# EAGLE design Wiegand (EAGLE 6.5.0)
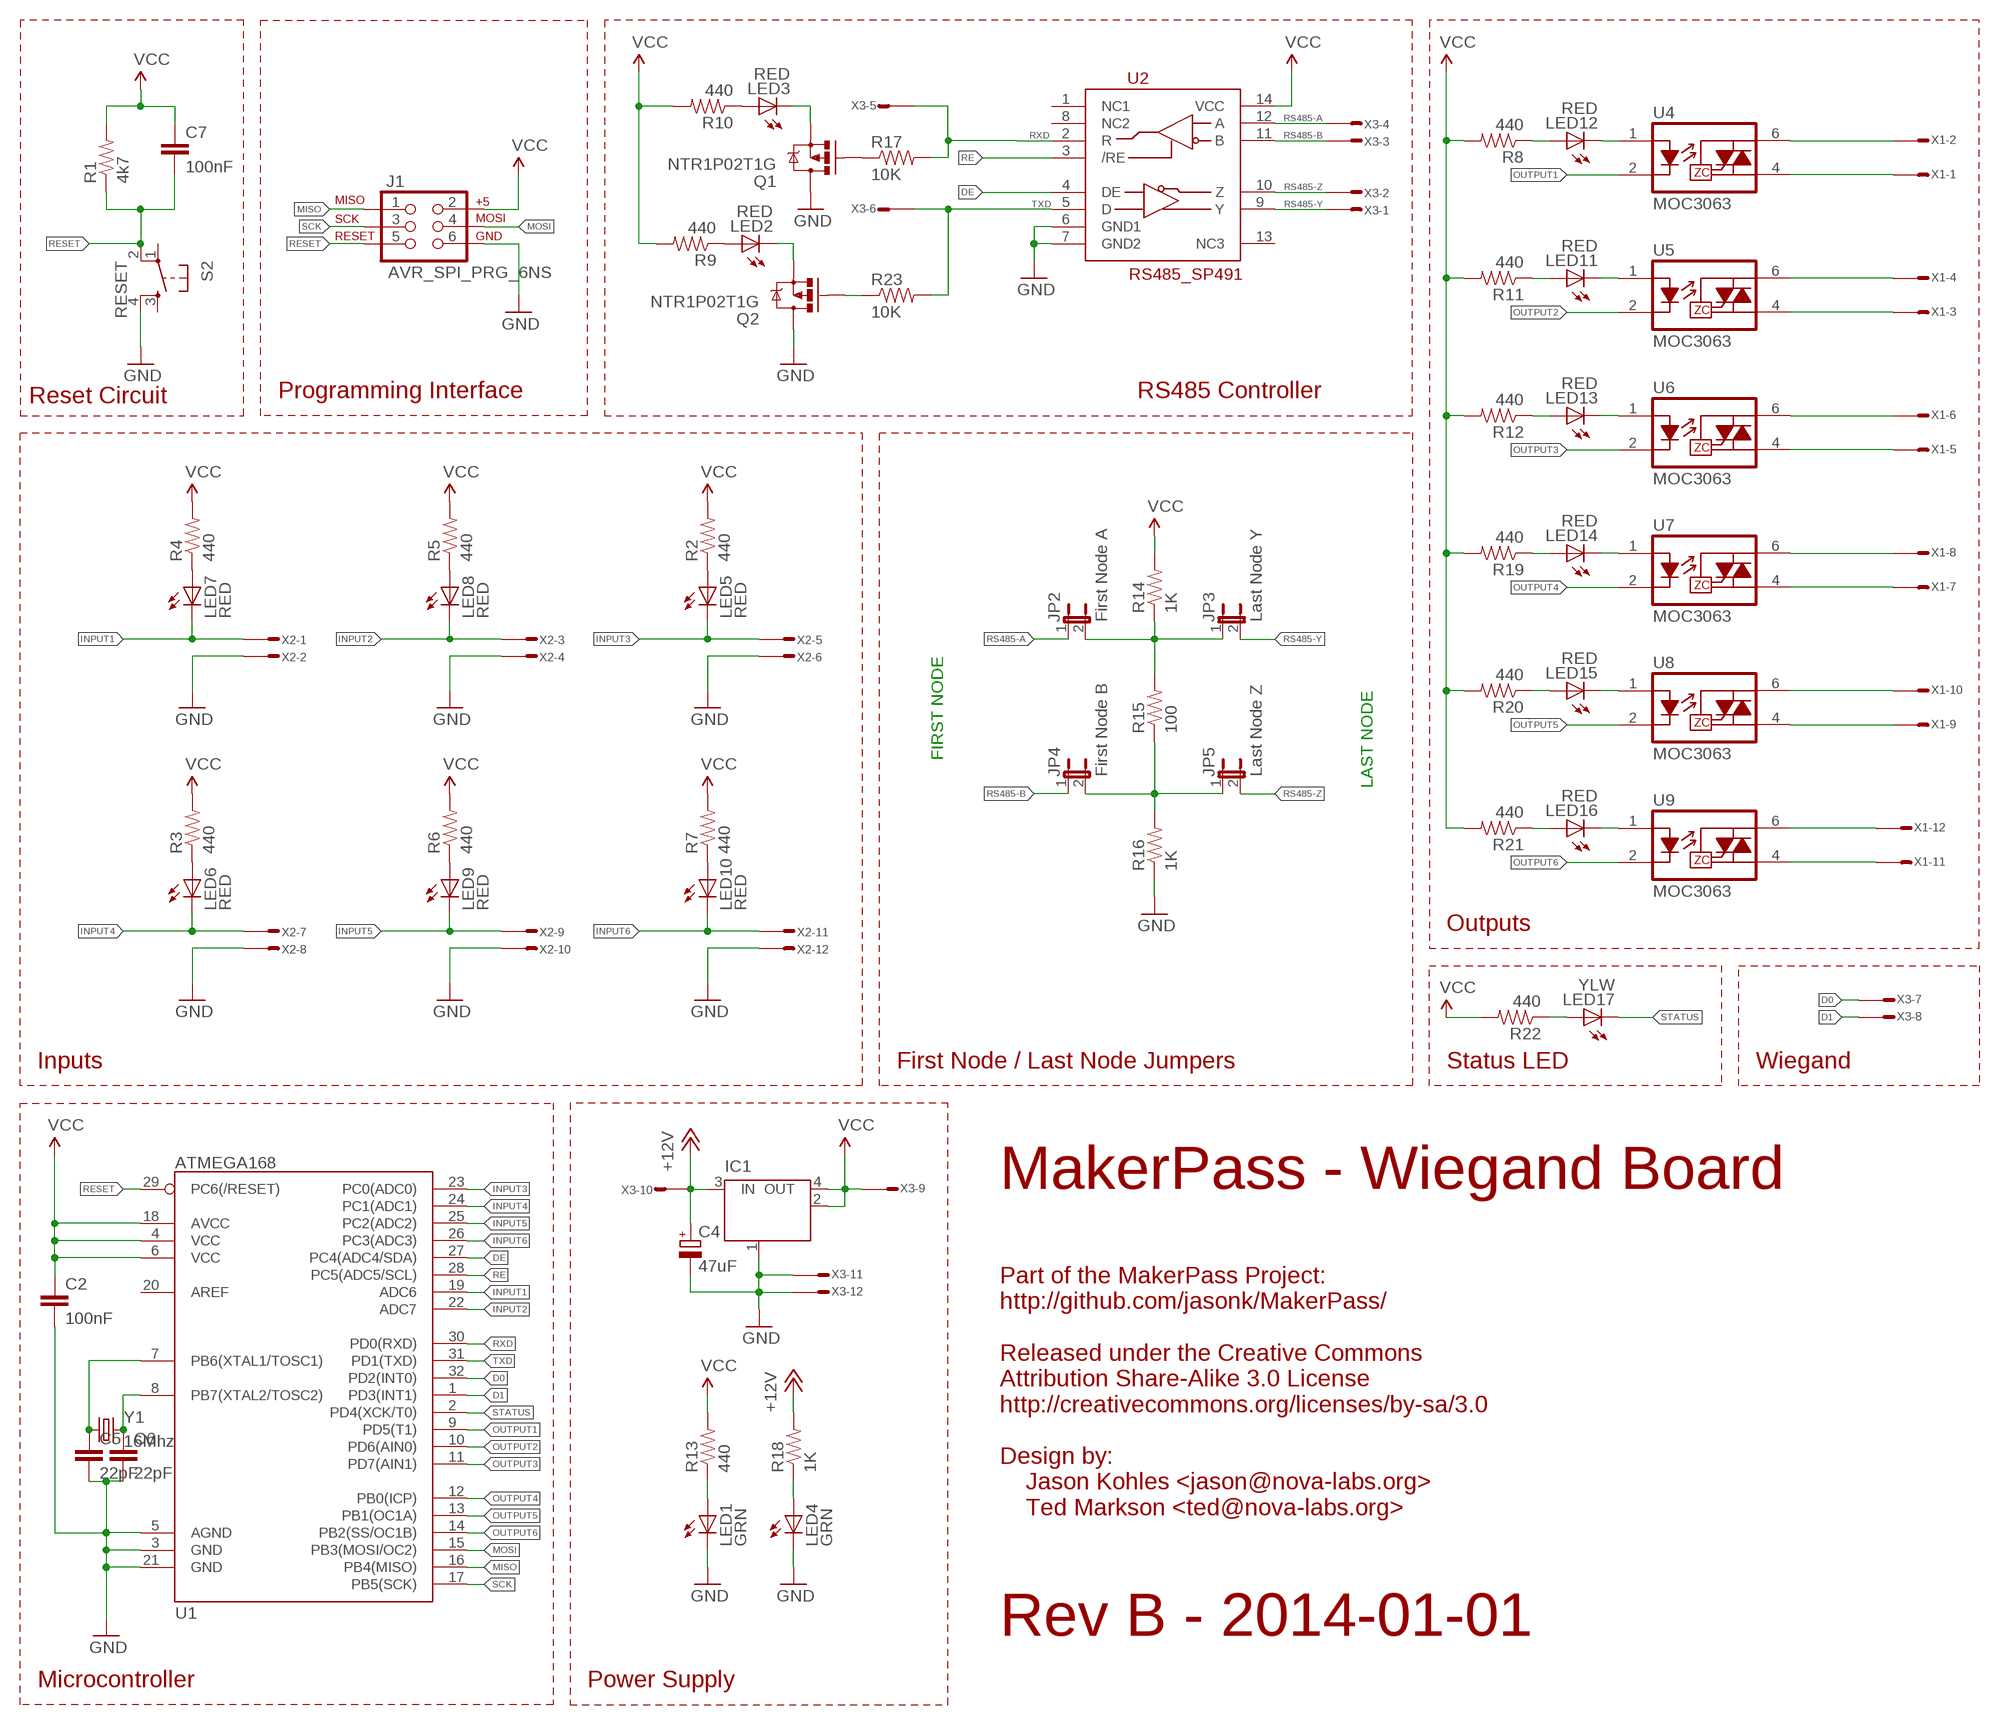
[diagram p0: schematic, sheet 1]

## Parts
C2  100nF  CAP0603-CAP  [0603-CAP]
C4  47uF  CPOL-EUD  [PANASONIC_D]
C5  22pF  CAP0603-CAP  [0603-CAP]
C6  22pF  CAP0603-CAP  [0603-CAP]
C7  100nF  CAP0603-CAP  [0603-CAP]
IC1  MC33269ST-3.3T3  [SOT223]
J1  AVR_SPI_PRG_6NS  [2X3-NS]
JP2  First Node A  JUMPER-2PTH  [1X02]
JP3  Last Node Y  JUMPER-2PTH  [1X02]
JP4  First Node B  JUMPER-2PTH  [1X02]
JP5  Last Node Z  JUMPER-2PTH  [1X02]
LED1  GRN  LED-0805  [LED-805]
LED2  RED  LED-0805  [LED-805]
LED3  RED  LED-0805  [LED-805]
LED4  GRN  LED-0805  [LED-805]
LED5  RED  LED-0805  [LED-805]
LED6  RED  LED-0805  [LED-805]
LED7  RED  LED-0805  [LED-805]
LED8  RED  LED-0805  [LED-805]
LED9  RED  LED-0805  [LED-805]
LED10  RED  LED-0805  [LED-805]
LED11  RED  LED-0805  [LED-805]
LED12  RED  LED-0805  [LED-805]
LED13  RED  LED-0805  [LED-805]
LED14  RED  LED-0805  [LED-805]
LED15  RED  LED-0805  [LED-805]
LED16  RED  LED-0805  [LED-805]
LED17  YLW  LED-0805  [LED-805]
Q1  NTR1P02T1G  MOSFET-PCHANNELSMD  [SOT23-3]
Q2  NTR1P02T1G  MOSFET-PCHANNELSMD  [SOT23-3]
R1  4k7  RESISTOR0603-RES  [0603-RES]
R2  440  RESISTOR0603-RES  [0603-RES]
R3  440  RESISTOR0603-RES  [0603-RES]
R4  440  RESISTOR0603-RES  [0603-RES]
R5  440  RESISTOR0603-RES  [0603-RES]
R6  440  RESISTOR0603-RES  [0603-RES]
R7  440  RESISTOR0603-RES  [0603-RES]
R8  440  RESISTOR0603-RES  [0603-RES]
R9  440  RESISTOR0603-RES  [0603-RES]
R10  440  RESISTOR0603-RES  [0603-RES]
R11  440  RESISTOR0603-RES  [0603-RES]
R12  440  RESISTOR0603-RES  [0603-RES]
R13  440  RESISTOR0603-RES  [0603-RES]
R14  1K  RESISTOR0603-RES  [0603-RES]
R15  100  RESISTOR0603-RES  [0603-RES]
R16  1K  RESISTOR0603-RES  [0603-RES]
R17  10K  RESISTOR0603-RES  [0603-RES]
R18  1K  RESISTOR0603-RES  [0603-RES]
R19  440  RESISTOR0603-RES  [0603-RES]
R20  440  RESISTOR0603-RES  [0603-RES]
R21  440  RESISTOR0603-RES  [0603-RES]
R22  440  RESISTOR0603-RES  [0603-RES]
R23  10K  RESISTOR0603-RES  [0603-RES]
S2  RESET  TAC_SWITCHSMD  [TACTILE_SWITCH_SMD]
U1  ATMEGA168  [TQFP32-08]
U2  RS485_SP491  [SOIC-14]
U4  MOC3063  MOC3063S  [DIP8SMD]
U5  MOC3063  MOC3063S  [DIP8SMD]
U6  MOC3063  MOC3063S  [DIP8SMD]
U7  MOC3063  MOC3063S  [DIP8SMD]
U8  MOC3063  MOC3063S  [DIP8SMD]
U9  MOC3063  MOC3063S  [DIP8SMD]
X1  CON-1X12-TERMBLOCK-3.5MM  [CON-1X12-TERMBLOCK-3.5MM]
X2  CON-1X12-TERMBLOCK-3.5MM  [CON-1X12-TERMBLOCK-3.5MM]
X3  CON-1X12-TERMBLOCK-3.5MM  [CON-1X12-TERMBLOCK-3.5MM]
Y1  16Mhz  CRYSTALSMD  [HC49UP]

## Nets
+12V [power]: C4.+ IC1.3(IN) R18.2 X3.10
D0: U1.32(PD2(INT0)) X3.7
D1: U1.1(PD3(INT1)) X3.8
DE: U1.27(PC4(ADC4/SDA)) U2.4(DE)
GND: C2.2 C4.- C5.2 C6.2 IC1.1(GND/ADJ) J1.6 LED1.C LED4.C Q1.3(D) Q2.3(D) R16.1 S2.4 U1.3(GND) U1.5(AGND) U1.21(GND) U2.6(GND1) U2.7(GND2) X2.2 X2.4 X2.6 X2.8 X2.10 X2.12 X3.11 X3.12
INPUT1: LED7.C U1.19(ADC6) X2.1
INPUT2: LED8.C U1.22(ADC7) X2.3
INPUT3: LED5.C U1.23(PC0(ADC0)) X2.5
INPUT4: LED6.C U1.24(PC1(ADC1)) X2.7
INPUT5: LED9.C U1.25(PC2(ADC2)) X2.9
INPUT6: LED10.C U1.26(PC3(ADC3)) X2.11
MISO: J1.1 U1.16(PB4(MISO))
MOSI: J1.4 U1.15(PB3(MOSI/OC2))
N$1: LED1.A R13.1
N$3: U8.4(T2) X1.9
N$4: U8.6(T1) X1.10
N$5: LED5.A R2.1
N$6: JP4.2 JP5.1 R15.1 R16.2
N$7: JP2.2 JP3.1 R14.1 R15.2
N$8: LED4.A R18.1
N$9: LED3.C Q1.2(S)
N$10: LED6.A R3.1
N$11: LED7.A R4.1
N$12: LED8.A R5.1
N$13: LED9.A R6.1
N$14: LED10.A R7.1
N$15: LED12.C U4.1(A)
N$16: LED12.A R8.1
N$17: U4.4(T2) X1.1
N$18: U4.6(T1) X1.2
N$19: U5.4(T2) X1.3
N$20: U5.6(T1) X1.4
N$21: LED11.A R11.1
N$22: LED11.C U5.1(A)
N$23: U6.4(T2) X1.5
N$24: U6.6(T1) X1.6
N$25: LED13.A R12.1
N$26: LED2.A R9.1
N$27: LED3.A R10.1
N$28: LED13.C U6.1(A)
N$29: U7.4(T2) X1.7
N$30: U7.6(T1) X1.8
N$31: LED14.A R19.1
N$32: LED14.C U7.1(A)
N$33: LED2.C Q2.2(S)
N$34: Q1.1(G) R17.1
N$35: LED15.A R20.1
N$36: LED15.C U8.1(A)
N$37: U9.4(T2) X1.11
N$38: U9.6(T1) X1.12
N$39: LED16.A R21.1
N$40: LED16.C U9.1(A)
N$41: LED17.A R22.1
N$42: Q2.1(G) R23.1
N$100: C5.1 U1.7(PB6(XTAL1/TOSC1)) Y1.1
N$101: C6.1 U1.8(PB7(XTAL2/TOSC2)) Y1.2
OUTPUT1: U1.9(PD5(T1)) U4.2(K)
OUTPUT2: U1.10(PD6(AIN0)) U5.2(K)
OUTPUT3: U1.11(PD7(AIN1)) U6.2(K)
OUTPUT4: U1.12(PB0(ICP)) U7.2(K)
OUTPUT5: U1.13(PB1(OC1A)) U8.2(K)
OUTPUT6: U1.14(PB2(SS/OC1B)) U9.2(K)
RE: U1.28(PC5(ADC5/SCL)) U2.3(/RE)
RESET: C7.2 J1.5 R1.1 S2.2 U1.29(PC6(/RESET))
RS485-A: JP2.1 U2.12(A) X3.4
RS485-B: JP4.1 U2.11(B) X3.3
RS485-Y: JP3.2 U2.9(Y) X3.1
RS485-Z: JP5.2 U2.10(Z) X3.2
RXD: R17.2 U1.30(PD0(RXD)) U2.2(R) X3.5
SCK: J1.3 U1.17(PB5(SCK))
STATUS: LED17.C U1.2(PD4(XCK/T0))
TXD: R23.2 U1.31(PD1(TXD)) U2.5(D) X3.6
VCC: C2.1 C7.1 IC1.2(OUT) IC1.4(OUT) J1.2 R1.2 R2.2 R3.2 R4.2 R5.2 R6.2 R7.2 R8.2 R9.2 R10.2 R11.2 R12.2 R13.2 R14.2 R19.2 R20.2 R21.2 R22.2 U1.4(VCC) U1.6(VCC) U1.18(AVCC) U2.14(VCC) X3.9
Unconnected: S2.1 S2.3 U1.20(AREF) U2.1(NC1) U2.8(NC2) U2.13(NC3)

## Notes on the sheet
- Reset Circuit | Programming Interface | RS485 Controller
- FIRST NODE
- LAST NODE
- Outputs
- Inputs | First Node / Last Node Jumpers | Status LED | Wiegand
- MakerPass - Wiegand Board
- Part of the MakerPass Project:
  http://github.com/jasonk/MakerPass/
  
  Released under the Creative Commons
  Attribution Share-Alike 3.0 License
  http://creativecommons.org/licenses/by-sa/3.0
  
  Design by:
      Jason Kohles <jason@nova-labs.org>
      Ted Markson <ted@nova-labs.org>
- Rev B - 2014-01-01
- Microcontroller | Power Supply

## Library data of the parts
C2 C7 = SparkFun:CAP: Capacitor Standard 0603 ceramic capacitor, and 0.1" leaded capacitor.; MFG_PN: 0603YC104KAT2A
C4 = rcl:CPOL-EU: POLARIZED CAPACITOR, European symbol; MFG_PN: EMVA250ADA470MF55G
C5 C6 = SparkFun:CAP: Capacitor Standard 0603 ceramic capacitor, and 0.1" leaded capacitor.; MFG_PN: 06035A220JAT2A
IC1 = linear:MC33269ST*: Adjustable Output Low Dropout Voltage Regulator 800 mA Source: http://www.onsemi.com/pub/Collateral/MC33269-D.PDF; MFG_PN: NCP1117ST50T3G
J1 = SparkFun-Connectors:AVR_SPI_PRG_6: AVR ISP 6 Pin This is the reduced ISP connector for AVR programming. Common on Arduino. This footprint will take up less PCB space and can be used with a 10-pin to 6-pin adapter such as SKU: BOB-08508
JP2-JP5 = SparkFun:JUMPER-2: Jumper Basic 0.1" spaced jumper. Use with breakaway headers.; MFG_PN: 1x2 pin header
LED1 LED4 = dp_devices:LED: Light Emitting Diode; MFG_PN: LG R971-KN-1
LED2 LED3 LED5-LED17 = dp_devices:LED: Light Emitting Diode; MFG_PN: LY R976-PS-36
Q1 Q2 = SparkFun:MOSFET-PCHANNEL; MFG_PN: NTR1P02T1G
R1 = SparkFun:RESISTOR: Resistor Basic schematic elements and footprints for 0603, 1206, and PTH resistors.; MFG_PN: ERJ-3GEYJ472V
R2-R13 R17 R19-R23 = SparkFun:RESISTOR: Resistor Basic schematic elements and footprints for 0603, 1206, and PTH resistors.; MFG_PN: ERJ3EKF3300V
R14-R16 R18 = SparkFun:RESISTOR: Resistor Basic schematic elements and footprints for 0603, 1206, and PTH resistors.; MFG_PN: ERJ-3EKF1001V
S2 = SparkFun:TAC_SWITCH: Momentary Switch Button commonly used for reset or general input. Spark Fun Electronics SKU : COM-00097; MFG_PN: PTS525SM10SMTRLFS
U1 = SparkFun-DigitalIC:ATMEGA168: Atmel 32-pin 8-bit micro, 16k flash.; MFG_PN: ATMEGA168-20AU
U2 = SparkFun:RS485_SP491; MFG_PN: SP491EEN-L
U4-U9 = SparkFun-DiscreteSemi:MOC3063*: Optotriac in DIP and SMD LED: Vf: 1.2V If: 5 mA TRIAC Vdrm: 600V Itsm: 1A Viso: 5000V DV/dt: 1500V/us DIP: MOC3063 SMD: MOC3063S; MFG_PN: MOC3063M
X1-X3 = LumisenseV6:CON-1X12: CON-1X12; MFG_PN: OSTTE120104
Y1 = SparkFun:CRYSTAL: Crystals Various standard crystals. Proven footprints. Spark Fun Electronics SKU : COM-00534; MFG_PN: FOXSDLF/160-20

## Board
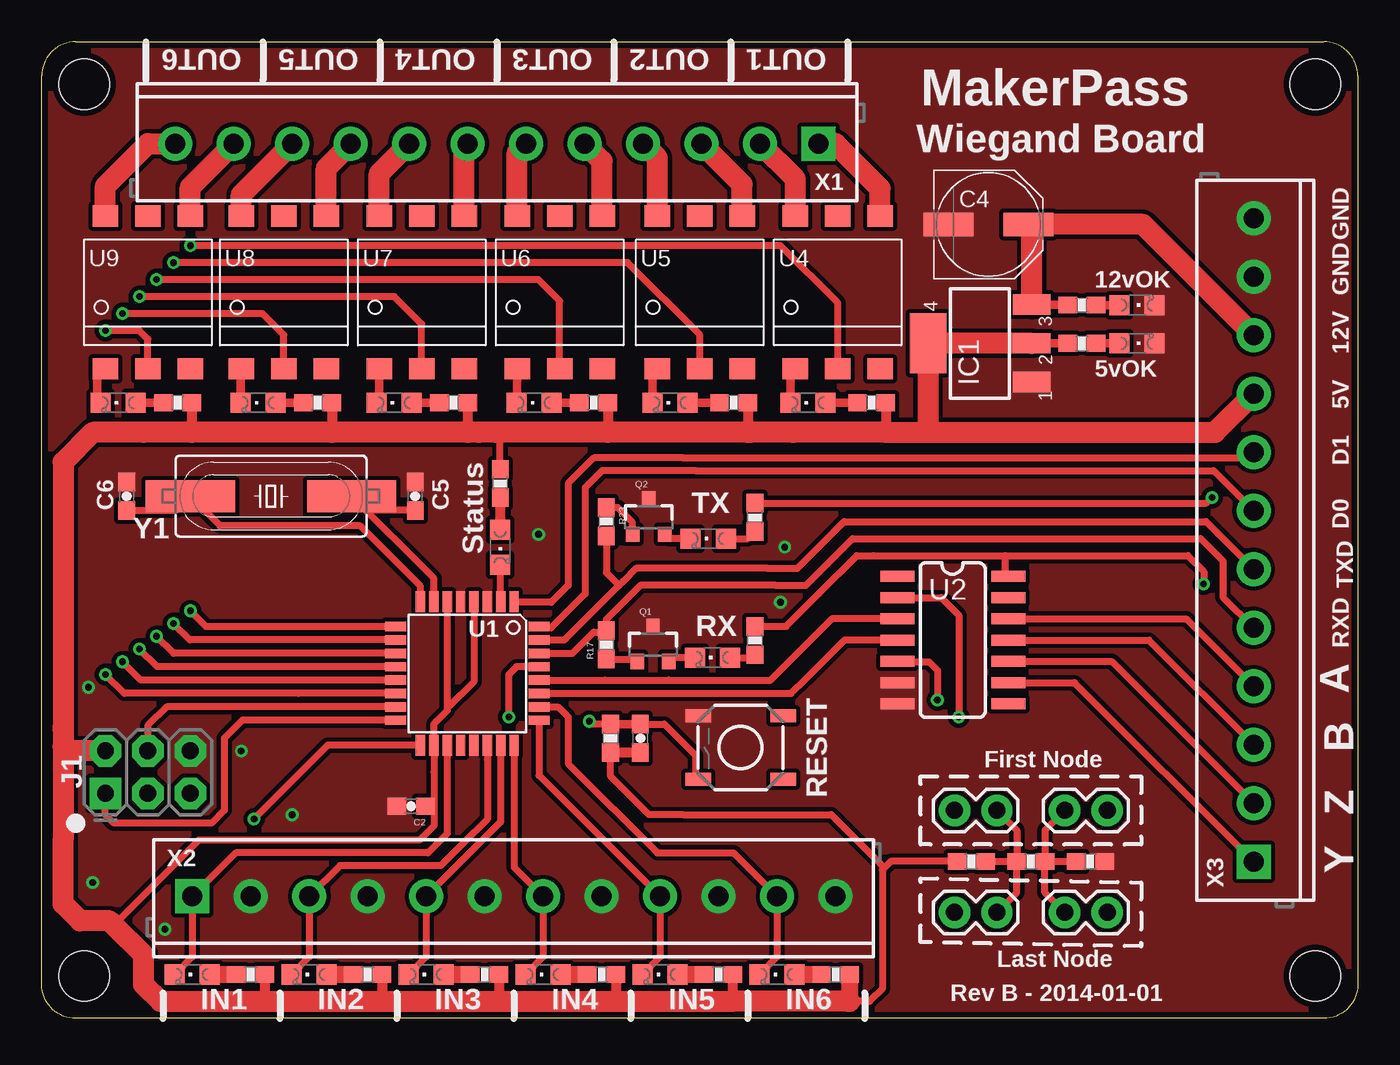
[diagram p1: board, top side]
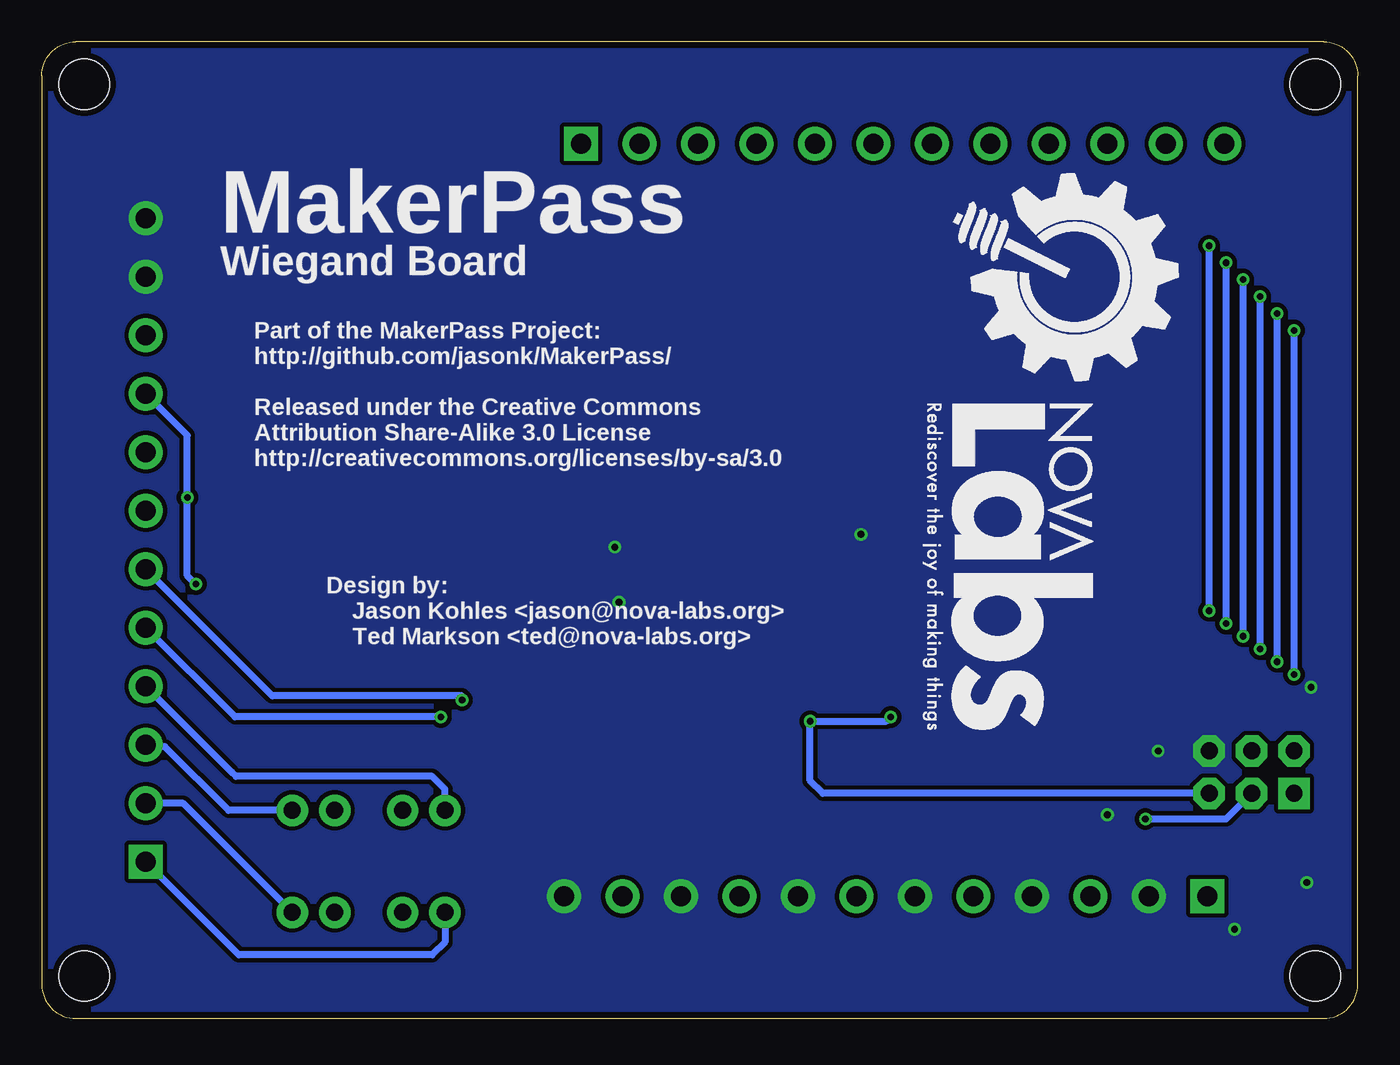
[diagram p2: board, bottom side, seen from below]

Size 78.74 x 58.42 mm. Coordinates in mm from the lower left corner, seen from the top.
Outline: 0,2.03 0,56.39 arc-90 2.03,58.42 76.71,58.42 arc-90 78.74,56.39 78.74,2.03 arc-90 76.71,0 2.03,0 arc-90 0,2.03
Copper layers (1*16): Top 0.0356mm / dielectric 1.5011mm / Bottom 0.0356mm
Design rules "OSHPark": minimum track width 6mil, minimum drill 13mil, track to track 6mil, track to pad 6mil, pad to pad 6mil, via to via 6mil, smd to smd 6mil, copper to edge 15mil, drill to drill 6mil, minimum pad ring 7mil, minimum via ring 7mil, stop-mask expansion 3mil, vias tented up to drill 0mil, thermal gap 10mil
Holes 3 mm at 2.54,2.54 76.2,2.54 2.54,55.88 76.2,55.88
tKeepout: area -0.5,-0.5 to 5.5,5.5; area 73.2,-0.5 to 79.2,5.5; area -0.5,52.9 to 5.5,58.9; area 73.2,52.9 to 79.2,58.9
bKeepout: area -0.5,-0.5 to 5.5,5.5; area 73.2,-0.5 to 79.2,5.5; area -0.5,52.9 to 5.5,58.9; area 73.2,52.9 to 79.2,58.9

### Footprints (pad centres in the part's own frame; a part is rotated, then mirrored left to right if it is on the bottom)
0603-CAP = smd 1.1 x 1: 1 -0.85,0; 2 0.85,0
PANASONIC_D = smd 3 x 1.4: + 2.4,0; - -2.4,0
SOT223 = smd 1.219 x 2.235: 1 -2.311,-3.099; 2 0,-3.099; 3 2.311,-3.099 | smd 3.6 x 2.2: 4 0,3.099
2X3-NS = drill 1.016 pad 1.88 square: 1 -2.54,-1.27 | drill 1.016 pad 1.88 octagon: 2 -2.54,1.27; 3 0,-1.27; 4 0,1.27; 5 2.54,-1.27; 6 2.54,1.27
1X02 = drill 1.016 pad 1.88: 1 0,0; 2 2.54,0
LED-805 = smd 1.2 x 1.2: A 0,-1.05; C 0,1.05
SOT23-3 = smd 0.8 x 0.9: 1 -0.95,-1; 2 0.95,-1; 3 0,1.1
0603-RES = smd 1.1 x 1: 1 -0.85,0; 2 0.85,0
TACTILE_SWITCH_SMD = smd 1.524 x 0.762: 1 -2.54,1.905; 2 2.54,1.905; 3 -2.54,-1.905; 4 2.54,-1.905
TQFP32-08 = smd 1.27 x 0.559: 1 -4.293,2.8; 2 -4.293,2; 3 -4.293,1.2; 4 -4.293,0.4; 5 -4.293,-0.4; 6 -4.293,-1.2; 7 -4.293,-2; 8 -4.293,-2.8; 17 4.293,-2.8; 18 4.293,-2; 19 4.293,-1.2; 20 4.293,-0.4; 21 4.293,0.4; 22 4.293,1.2; 23 4.293,2; 24 4.293,2.8 | smd 0.559 x 1.27: 9 -2.8,-4.293; 10 -2,-4.293; 11 -1.2,-4.293; 12 -0.4,-4.293; 13 0.4,-4.293; 14 1.2,-4.293; 15 2,-4.293; 16 2.8,-4.293; 25 2.8,4.293; 26 2,4.293; 27 1.2,4.293; 28 0.4,4.293; 29 -0.4,4.293; 30 -1.2,4.293; 31 -2,4.293; 32 -2.8,4.293
SOIC-14 = smd 0.66 x 2.032: 1 -4.445,-3.315; 2 -3.175,-3.315; 3 -1.905,-3.315; 4 -0.635,-3.315; 5 0.635,-3.315; 6 1.905,-3.315; 7 3.175,-3.315; 8 3.175,3.315; 9 1.905,3.315; 10 0.635,3.315; 11 -0.635,3.315; 12 -1.905,3.315; 13 -3.175,3.315; 14 -4.445,3.315
DIP8SMD = smd 1.524 x 1.27: 1 -2.54,-4.572; 2 0,-4.572; 3 2.54,-4.572; 4 2.54,4.572; 5 0,4.572; 6 -2.54,4.572
CON-1X12-TERMBLOCK-3.5MM = drill 1.2 pad 2.032 square: 1 0,0 | drill 1.2 pad 2.032: 2 3.5,0; 3 7,0; 4 10.5,0; 5 14,0; 6 17.5,0; 7 21,0; 8 24.5,0; 9 28,0; 10 31.5,0; 11 35,0; 12 38.5,0
HC49UP = smd 5.334 x 1.93: 1 -4.826,0; 2 4.826,0

### Placement (x,y rotation side)
C2  22.1,12.7 180 top
C4  56.64,47.5 0 top
C5  22.35,31.24 90 top
C6  5.08,31.24 90 top
C7  35.81,16.76 90 top
IC1  56.13,40.39 90 top
J1  6.35,14.73 0 top
JP2  54.61,12.45 0 top
JP3  57.15,6.35 180 top
JP4  63.75,12.45 180 top
JP5  61.21,6.35 0 top
LED1  65.53,40.39 270 top
LED2  39.88,28.7 90 top
LED3  40.13,21.59 90 top
LED4  65.53,42.67 270 top
LED5  23,2.63 90 top
LED6  30,2.63 90 top
LED7  9,2.63 90 top
LED8  16,2.63 90 top
LED9  37,2.63 90 top
LED10  44,2.63 90 top
LED11  37.59,36.83 90 top
LED12  45.85,36.83 90 top
LED13  29.46,36.83 90 top
LED14  21.08,36.83 90 top
LED15  12.95,36.83 90 top
LED16  4.57,36.83 90 top
LED17  27.43,28.19 180 top
Q1  36.58,22.35 0 top
Q2  36.32,29.97 0 top
R1  34.04,16.76 270 top
R2  26.5,2.63 0 top
R3  33.5,2.63 0 top
R4  12.5,2.63 0 top
R5  19.5,2.63 0 top
R6  40.5,2.63 0 top
R7  47.5,2.63 0 top
R8  49.66,36.83 0 top
R9  42.67,29.97 90 top
R10  42.67,22.61 90 top
R11  41.4,36.83 0 top
R12  33.02,36.83 0 top
R13  62.23,40.39 180 top
R14  55.63,9.4 180 top
R15  59.18,9.4 180 top
R16  62.74,9.4 180 top
R17  33.78,22.35 90 top
R18  62.23,42.67 180 top
R19  24.64,36.83 0 top
R20  16.51,36.83 0 top
R21  8.13,36.83 0 top
R22  27.43,32 90 top
R23  33.78,29.72 270 top
S2  41.82,16.21 180 top
U1  25.46,20.64 270 top
U2  54.51,22 270 top
U4  47.62,43.43 0 top
U5  39.37,43.43 0 top
U6  30.99,43.43 0 top
U7  22.73,43.43 0 top
U8  14.48,43.43 0 top
U9  6.35,43.43 0 top
U$4  [NOVALABS]  26.92,51.05 270 bottom
X1  46.48,52.32 180 top
X2  9,7.3 0 top
X3  72.51,9.37 90 top
Y1  13.72,31.24 180 top

### Tracks (layer width: path | path; a pad name or v marks a point on that pad's centre or on a via)
+12V
  Top 0.508: IC1.3 61.35,42.7 R18.2
  Top 1.27: C4.+ 59.23,47.5 | X3.10 65.89,47.5 C4.+ | IC1.3 59.23,47.31 C4.+
D0
  Top 0.406: 29.79,23.44 U1.32 29.83,23.37 30.48,23.37 32.51,25.4 32.51,31.75 33.53,32.77 39.12,32.77 70.12,32.77 X3.7
D1
  Top 0.406: X3.8 72.17,33.53 38.35,33.53 33.02,33.53 31.5,32 31.5,25.91 30.48,24.89 28.3,24.89 U1.1 28.49,24.93
DE
  Top 0.406: U1.27 35.19,19.44 36.71,19.44 44.84,19.44 45.72,20.32 48.03,22.64 U2.4
GND  (via drill 0.41)
  other vias: 2.79,19.81 7.37,5.33 44.45,28.19 44.2,24.89 3.05,8.13 11.94,16 14.99,12.19 29.72,28.96
  pour Top (isolate 0.254, rank 6, no thermals): 0,0 78.74,0 78.74,58.42 0,58.42
  pour Bottom (isolate 0.254, no thermals): 0,0 78.74,0 78.74,58.42 0,58.42
INPUT1
  Top 0.406: LED7.C 9,3.68 X2.1 11.6,9.91 23.11,9.91 24.26,11.05 U1.19
INPUT2
  Top 0.406: LED8.C 16,3.68 X2.3 17.84,9.14 23.88,9.14 25.15,10.41 26.66,11.93 26.66,15.49 U1.22
INPUT3
  Top 0.406: LED5.C 23,3.68 X2.5 27.46,11.76 U1.23
INPUT4
  Top 0.406: LED6.C 30,3.68 X2.7 28.26,9.04 U1.24
INPUT5
  Top 0.406: LED9.C 37,3.68 X2.9 29.75,14.55 U1.25
INPUT6
  Top 0.406: LED10.C 44,3.68 X2.11 41.4,9.91 36.83,9.91 31.5,15.24 31.5,18.03 30.89,18.64 U1.26
MISO
  Top 0.406: U1.16 12,17.84 10.92,16.76 10.92,12.45 10.16,11.68 4.32,11.68 3.81,12.19 J1.1
MOSI
  Top 0.406: U1.15 7.46,18.64 6.35,17.53 J1.4
N$1
  Top 0.508: LED1.A R13.1
N$3
  Top 1.27: U8.4 17.02,50.86 X1.9
N$4
  Top 1.27: U8.6 11.94,49.28 X1.10
N$5
  Top 1.016: R2.1 LED5.A
N$6
  Top 0.406: R15.1 R16.2 | JP4.2 60.03,11.26 R15.1 | JP5.1 60.03,7.53 R15.1
N$7
  Top 0.406: R14.1 R15.2 | JP2.2 58.33,11.26 R15.2 | JP3.1 58.33,7.53 R15.2
N$8
  Top 0.508: R18.1 LED4.A
N$9
  Top 0.406: LED3.C 37.76,21.59 Q1.2
N$10
  Top 1.016: R3.1 LED6.A
N$11
  Top 1.016: R4.1 LED7.A
N$12
  Top 1.016: R5.1 LED8.A
N$13
  Top 1.016: R6.1 LED9.A
N$14
  Top 1.016: R7.1 LED10.A
N$15
  Top 0.508: LED12.C 44.8,38.57 U4.1
N$16
  Top 0.508: LED12.A R8.1
N$17
  Top 1.27: U4.4 50.16,49.66 47.5,52.32 X1.1
N$18
  Top 1.27: U4.6 45.09,50.22 X1.2
N$19
  Top 1.27: U5.4 41.91,49.9 X1.3
N$20
  Top 1.27: U5.6 36.83,51.48 X1.4
N$21
  Top 0.508: LED11.A R11.1
N$22
  Top 0.508: LED11.C 36.54,38.57 U5.1
N$23
  Top 1.27: U6.4 33.53,51.28 X1.5
N$24
  Top 1.27: U6.6 28.45,51.79 X1.6
N$25
  Top 0.508: R12.1 LED13.A
N$26
  Top 0.406: LED2.A 42.25,28.7 R9.1
N$27
  Top 0.406: LED3.A 42.51,21.59 R10.1
N$28
  Top 0.508: U6.1 28.45,36.86 LED13.C
N$29
  Top 1.27: U7.4 25.27,52.12 X1.7
N$30
  Top 1.27: U7.6 20.19,50.53 X1.8
N$31
  Top 0.508: LED14.A R19.1
N$32
  Top 0.508: U7.1 20.19,36.99 LED14.C
N$33
  Top 0.406: LED2.C 37.54,28.7 Q2.2
N$34
  Top 0.406: R17.1 35.48,21.5 Q1.1
N$35
  Top 0.508: LED15.A R20.1
N$36
  Top 0.508: LED15.C 11.9,38.83 U8.1
N$37
  Top 1.27: U9.4 8.89,49.73 X1.11
N$38
  Top 1.27: U9.6 3.81,49.78 6.35,52.32 X1.12
N$39
  Top 0.508: LED16.A R21.1
N$40
  Top 0.508: U9.1 3.33,38.38 3.33,37.03 LED16.C
N$41
  Top 0.61: R22.1 LED17.A
N$42
  Top 0.406: R23.1 34.46,30.57 35.31,29.72 35.31,29.04 Q2.1
N$100
  Top 0.406: U1.7 23.46,26.32 Y1.1 19.39,30.39 C5.1
N$101
  Top 0.406: U1.8 22.66,25.85 19.05,29.46 10.67,29.46 Y1.2 8.04,30.39 C6.1
OUTPUT1  (via drill 0.41)
  Top 0.406: U4.2 47.62,42.8 44.2,46.23 v8.89,46.23 | U1.9 9.83,23.44 v8.89,24.38
  Bottom 0.406: v8.89,24.38 v8.89,46.23
OUTPUT2  (via drill 0.41)
  Top 0.406: U1.10 8.86,22.64 v7.87,23.62 | U5.2 39.37,40.89 35.05,45.21 v7.87,45.21
  Bottom 0.406: v7.87,23.62 v7.87,45.21
OUTPUT3  (via drill 0.41)
  Top 0.406: U1.11 7.88,21.84 v6.86,22.86 | U6.2 30.99,42.93 29.72,44.2 v6.86,44.2
  Bottom 0.406: v6.86,22.86 v6.86,44.2
OUTPUT4  (via drill 0.41)
  Top 0.406: U1.12 6.9,21.04 v5.84,22.1 | U7.2 22.73,41.53 21.08,43.18 v5.84,43.18
  Bottom 0.406: v5.84,22.1 v5.84,43.18
OUTPUT5  (via drill 0.41)
  Top 0.406: U1.13 5.92,20.24 v4.83,21.34 | U8.2 14.48,40.89 13.21,42.16 v4.83,42.16
  Bottom 0.406: v4.83,21.34 v4.83,42.16
OUTPUT6  (via drill 0.41)
  Top 0.406: U1.14 15.36,19.44 4.94,19.44 v3.81,20.57 | U9.2 6.35,40.64 5.84,41.15 v3.81,41.15
  Bottom 0.406: v3.81,20.57 v3.81,41.15
RE
  Top 0.406: U1.28 33.7,20.24 37.51,20.24 43.61,20.24 44.45,21.08 47.27,23.91 U2.3
RESET  (via drill 0.41)
  Top 0.406: U1.29 28.41,21.04 27.94,20.57 v27.94,18.03 | C7.2 37.25,17.61 39.12,15.75 39.12,14.46 S2.2 | R1.1 32.93,17.61 v32.77,17.78
  Top 0.508: C7.2 R1.1
  Bottom 0.406: v27.94,18.03 28.19,17.78 v32.77,17.78 32.77,14.22 32,13.46 J1.5
RS485-A
  Top 0.406: U2.12 68.48,23.91 X3.4
  Bottom 0.406: JP2.1 54.61,12.95 54.61,13.72 55.37,14.48 67.12,14.48 67.37,14.73 X3.4
RS485-B
  Top 0.406: U2.11 66.25,22.64 X3.3
  Bottom 0.406: JP4.1 67.56,12.45 71.37,16.26 72.4,16.26 X3.3
RS485-Y
  Top 0.406: U2.9 61.79,20.09 X3.1
  Bottom 0.406: JP3.2 54.61,4.57 55.37,3.81 66.95,3.81 X3.1
RS485-Z
  Top 0.406: U2.10 64.02,21.36 X3.2
  Bottom 0.406: JP5.2 70.28,12.87 X3.2
RXD  (via drill 0.41)
  Top 0.406: X3.5 70.68,25.21 70.68,27.37 69.34,28.7 48.51,28.7 45.72,25.91 43.94,25.91 35.81,25.91 35.05,25.15 33.78,23.88 R17.2 33.69,23.11 33.02,23.11 31.75,21.84 U1.30 | U2.2 53.82,25.18 54.86,24.13 v54.86,18.03
  Bottom 0.406: v54.86,18.03 67.18,18.03 X3.5
SCK  (via drill 0.41)
  Top 0.406: U1.17 17.11,16.35 v12.7,11.94
  Bottom 0.406: v12.7,11.94 7.87,11.94 J1.3
STATUS
  Top 0.406: U1.2 27.46,27.11 LED17.C
TXD  (via drill 0.41)
  Top 0.406: U2.5 51.17,21.34 50.55,21.34 53.09,21.34 53.59,20.83 v53.59,19.05 | X3.6 70.39,28.99 69.92,29.46 69.67,29.72 48.01,29.72 45.21,26.92 43.43,26.92 35.56,26.92 34.8,26.16 34.54,25.91 | U1.31 31.28,22.64 34.54,25.91 | R23.2 33.78,26.67 34.54,25.91
  Bottom 0.406: X3.6 64.95,19.3 53.59,19.3 v53.59,19.05
VCC  (via drill 0.41)
  Top 0.406: 25.86,34.75 26.16,35.05 | R22.2 27.43,34.8 27.18,35.05 | 42.67,34.8 42.42,35.05 | 35.65,15.91 R1.2 34.04,14.48 36.32,12.19 38.35,12.19 47.24,12.19 50.29,9.14 50.29,8.89 | 50.29,8.89 50.29,1.78 49.53,1.02 48.26,1.02 | 58.65,26.45 U2.14 57.8,26.42 57.66,26.55 57.66,27.69 | R14.2 50.8,9.4 50.29,8.89 | R10.2 44.54,23.46 46.48,25.4 48.77,27.69 49.78,27.69 57.66,27.69 | 57.66,27.69 68.58,27.69 69.52,26.75 v69.52,25.98 | R9.2 69.68,30.82 v70.03,31.17 | 23.46,12.45 23.46,14.73 U1.18 23.46,17.62 23.62,17.78 24.26,18.42 24.26,18.54 | 23.46,12.45 23.46,11.52 22.61,10.67 9.4,10.67 4.32,5.59 | U1.6 24.26,18.54 | C2.1 23.21,12.7 23.46,12.45 | U1.4 25.86,20.14 24.26,18.54
  Top 0.508: R13.2 IC1.2
  Top 0.61: 41.35,1.02 R6.2 | R3.2 34.35,1.02 | R2.2 27.35,1.02 | R5.2 20.35,1.02 | R4.2 13.35,1.02 | R1.2 C7.1 | R8.2 50.51,35.05 | R11.2 42.25,35.05 | R12.2 33.87,35.05 | R19.2 25.49,35.05 | R20.2 17.36,35.05 | R21.2 8.98,35.05
  Top 1.016: 48.35,1.02 R7.2
  Top 1.27: 48.35,1.02 48.26,1.02 41.35,1.02 34.35,1.02 27.35,1.02 20.35,1.02 13.35,1.02 7.11,1.02 6.1,2.03 6.1,3.81 4.32,5.59 4.06,5.84 2.29,5.84 1.27,6.86 1.27,10.67 1.27,16.26 | 1.27,16.26 1.27,17.27 1.27,17.44 1.27,33.27 3.05,35.05 6.1,35.05 8.98,35.05 17.36,35.05 25.49,35.05 26.16,35.05 27.18,35.05 33.87,35.05 42.25,35.05 42.42,35.05 44.96,35.05 50.51,35.05 52.83,35.05 | 52.83,35.05 53.85,35.05 54.86,35.05 70.19,35.05 X3.9 | IC1.2 IC1.4 53.03,35.26 52.83,35.05 | J1.2 1.52,16 1.27,16.26
  Bottom 0.406: X3.9 70.03,34.89 v70.03,31.17 70.03,26.49 v69.52,25.98

### Text on the board
tPlace: Status
bPlace: Wiegand Board
tNames: OUT6 | OUT5 | OUT4 | OUT3 | OUT2 | OUT1 | MakerPass | Wiegand Board | GND | 12vOK | GND | 12V | 5vOK | 5V | D1 | TX | D0 | TXD | RX | RXD | A | B | First Node | RESET | Z | Y | Last Node | IN1 | IN2 | IN3 | IN4 | IN5 | IN6 | Rev B - 2014-01-01
bNames: MakerPass | Part of the MakerPass Project: / http://github.com/jasonk/MakerPass/ / / Released under the Creative Commons / Attribution Share-Alike 3.0 License / http://creativecommons.org/licenses/by-sa/3.0 | Design by: / Jason Kohles <jason@nova-labs.org> / Ted Markson <ted@nova-labs.org>